# Altium schematic sheet Xe_VDK_Schematic.SchDoc
size A4
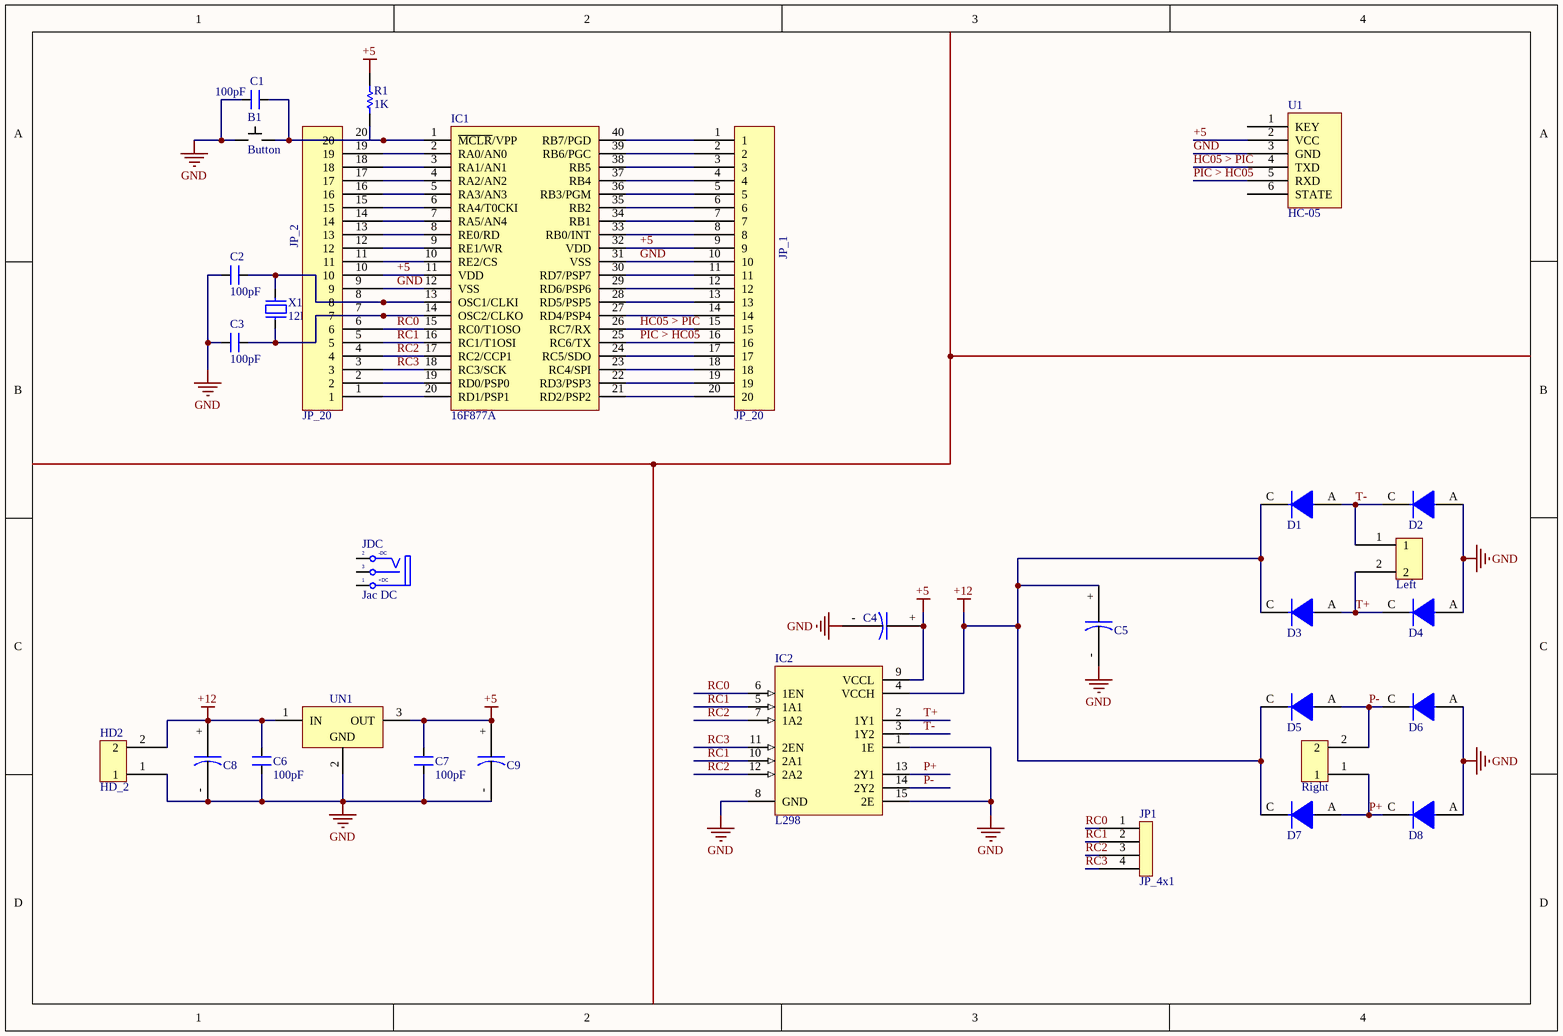
[diagram p0: Xe_VDK_Schematic.SchDoc]

## Parts
B1  Button  [Button - 4-pin]
C1  100pF  [CN1]
C2  100pF  [CN1]
C3  100pF  [CN1]
C4  Pol-Cap  [Pol_200mil]  (value not drawn)
C5  Pol-Cap  [Pol_200mil]  (value not drawn)
C6  100pF  [CN1]
C7  100pF  [CN1]
C8  Pol-Cap  [POL_250mil]  (value not drawn)
C9  Pol-Cap  [POL_250mil]  (value not drawn)
D1  Diode  [Diode]  (value not drawn)
D2  Diode  [Diode]  (value not drawn)
D3  Diode  [Diode]  (value not drawn)
D4  Diode  [Diode]  (value not drawn)
D5  Diode  [Diode]  (value not drawn)
D6  Diode  [Diode]  (value not drawn)
D7  Diode  [Diode]  (value not drawn)
D8  Diode  [Diode]  (value not drawn)
HD2  HD_2  [Header 2]
IC1  16F877A  [DIP40/W0.6]
IC2  L298  [DIP15SL2]
JDC  Jac DC  [DC0]
JP1  JP_4x1  [JP_4x1]
JP_1  JP_20  [JP_20]
JP_2  JP_20  [JP_20]
Left  HD_2  [Header 2]  (value not drawn)
R1  value 1K  [RES 1/2W]  (hidden comment: RESISTOR)
Right  HD_2  [Header 2]  (value not drawn)
U1  HC-05  [HC-05]
UN1  LM7805  [QTO-220]  (value not drawn)
X1  12Mhz  [XT2]

## Nets
+5: C4.+ C7.2 C9.+ IC1.11(VDD) IC1.32(VDD) IC2.9(VCCL) JP_1.9 JP_2.10 R1.2 U1.2(VCC) UN1.3(OUT)
+12: C5.+ C6.2 C8.+ D1.C D3.C D5.C D7.C HD2.2 IC2.4(VCCH) UN1.1(IN)
GND: B1.1 C1.1 C2.1 C3.1 C4.- C5.- C6.1 C7.1 C8.- C9.- D2.A D4.A D6.A D8.A HD2.1 IC1.12(VSS) IC1.31(VSS) IC2.1(1E) IC2.8(GND) IC2.15(2E) JP_1.10 JP_2.9 U1.3(GND) UN1.2(GND)
HC05 > PIC: IC1.26(RC7/RX) JP_1.15 U1.4(TXD)
P+: D7.A D8.C IC2.13(2Y1) Right.1
P-: D5.A D6.C IC2.14(2Y2) Right.2
PIC > HC05: IC1.25(RC6/TX) JP_1.16 U1.5(RXD)
RC0: IC1.15(RC0/T1OSO) IC2.6(1EN) JP1.1 JP_2.6
RC1: IC1.16(RC1/T1OSI) IC2.5(1A1) IC2.10(2A1) JP1.2 JP_2.5
RC2: IC1.17(RC2/CCP1) IC2.7(1A2) IC2.12(2A2) JP1.3 JP_2.4
RC3: IC1.18(RC3/SCK) IC2.11(2EN) JP1.4 JP_2.3
T+: D3.A D4.C IC2.2(1Y1) Left.2
T-: D1.A D2.C IC2.3(1Y2) Left.1
NetB1_2: B1.2 C1.2 IC1.1(~{MCLR}/VPP) JP_2.20 R1.1
NetC2_2: C2.2 IC1.13(OSC1/CLKI) JP_2.8 X1.2
NetC3_2: C3.2 IC1.14(OSC2/CLKO) JP_2.7 X1.1
NetIC1_2: IC1.2(RA0/AN0) JP_2.19
NetIC1_3: IC1.3(RA1/AN1) JP_2.18
NetIC1_4: IC1.4(RA2/AN2) JP_2.17
NetIC1_5: IC1.5(RA3/AN3) JP_2.16
NetIC1_6: IC1.6(RA4/T0CKI) JP_2.15
NetIC1_7: IC1.7(RA5/AN4) JP_2.14
NetIC1_8: IC1.8(RE0/RD) JP_2.13
NetIC1_9: IC1.9(RE1/WR) JP_2.12
NetIC1_10: IC1.10(RE2/CS) JP_2.11
NetIC1_19: IC1.19(RD0/PSP0) JP_2.2
NetIC1_20: IC1.20(RD1/PSP1) JP_2.1
NetIC1_21: IC1.21(RD2/PSP2) JP_1.20
NetIC1_22: IC1.22(RD3/PSP3) JP_1.19
NetIC1_23: IC1.23(RC4/SPI) JP_1.18
NetIC1_24: IC1.24(RC5/SDO) JP_1.17
NetIC1_27: IC1.27(RD4/PSP4) JP_1.14
NetIC1_28: IC1.28(RD5/PSP5) JP_1.13
NetIC1_29: IC1.29(RD6/PSP6) JP_1.12
NetIC1_30: IC1.30(RD7/PSP7) JP_1.11
NetIC1_33: IC1.33(RB0/INT) JP_1.8
NetIC1_34: IC1.34(RB1) JP_1.7
NetIC1_35: IC1.35(RB2) JP_1.6
NetIC1_36: IC1.36(RB3/PGM) JP_1.5
NetIC1_37: IC1.37(RB4) JP_1.4
NetIC1_38: IC1.38(RB5) JP_1.3
NetIC1_39: IC1.39(RB6/PGC) JP_1.2
NetIC1_40: IC1.40(RB7/PGD) JP_1.1

Not connected (* = marked no-connect by the designer): JDC 1(T) 2(TN) 3(S); U1 1(KEY) 6(STATE)

## Notes on the sheet
- (in symbol DCIN) -DC; +DC

## Library data of the parts
C1-C3 C6 C7 = CN1: Cap np  1pF - 472pF; Value: 100pF
C4 C5 C8 C9 = Pol-Cap: Tụ điện phân cực
IC1 = 16F877: 8K FLASH, 368B RAM, 256B EFROM; Value: PIC16F877A; Value: DIP 40; Copyright by: VanDungEvn
IC2 = L298: Dual Full-H Driver; Note: The tab is elec is connected to GND pin; Published: 15-May-2002; DatasheetVersion: Jun-1990; PackageReference: KV015; Publisher: Altium Limited; PackageDescription: TO, Thru-Hole, Vertical, Heatsink Mounted; 15 Bent Staggered Leads; Pitch 1.27 mm; ComponentLink1Description: Manufacturer Link; ComponentLink1URL: http://www.ti.com/
JDC = DCIN: Jac DC input; Value: Jac DC
UN1 = LM7805: Positive Voltage Regulator
X1 = XT2: Crystal, 32.768 KHz, -40 to 85 degC, 3.2 x 1.5 x 0.9 mm SMD; Value: 4Mhz